# EasyEDA schematic SCH_555Timer_2021-06-30.json
TITLE: 555 TIMER AS ASTABLE MULTIVIBRATOR; REV: 1.0; Date: 2021-06-22; Sheet: 1/1; Drawn By: Surya Narayan Jena; Company: SPECTRUMCET
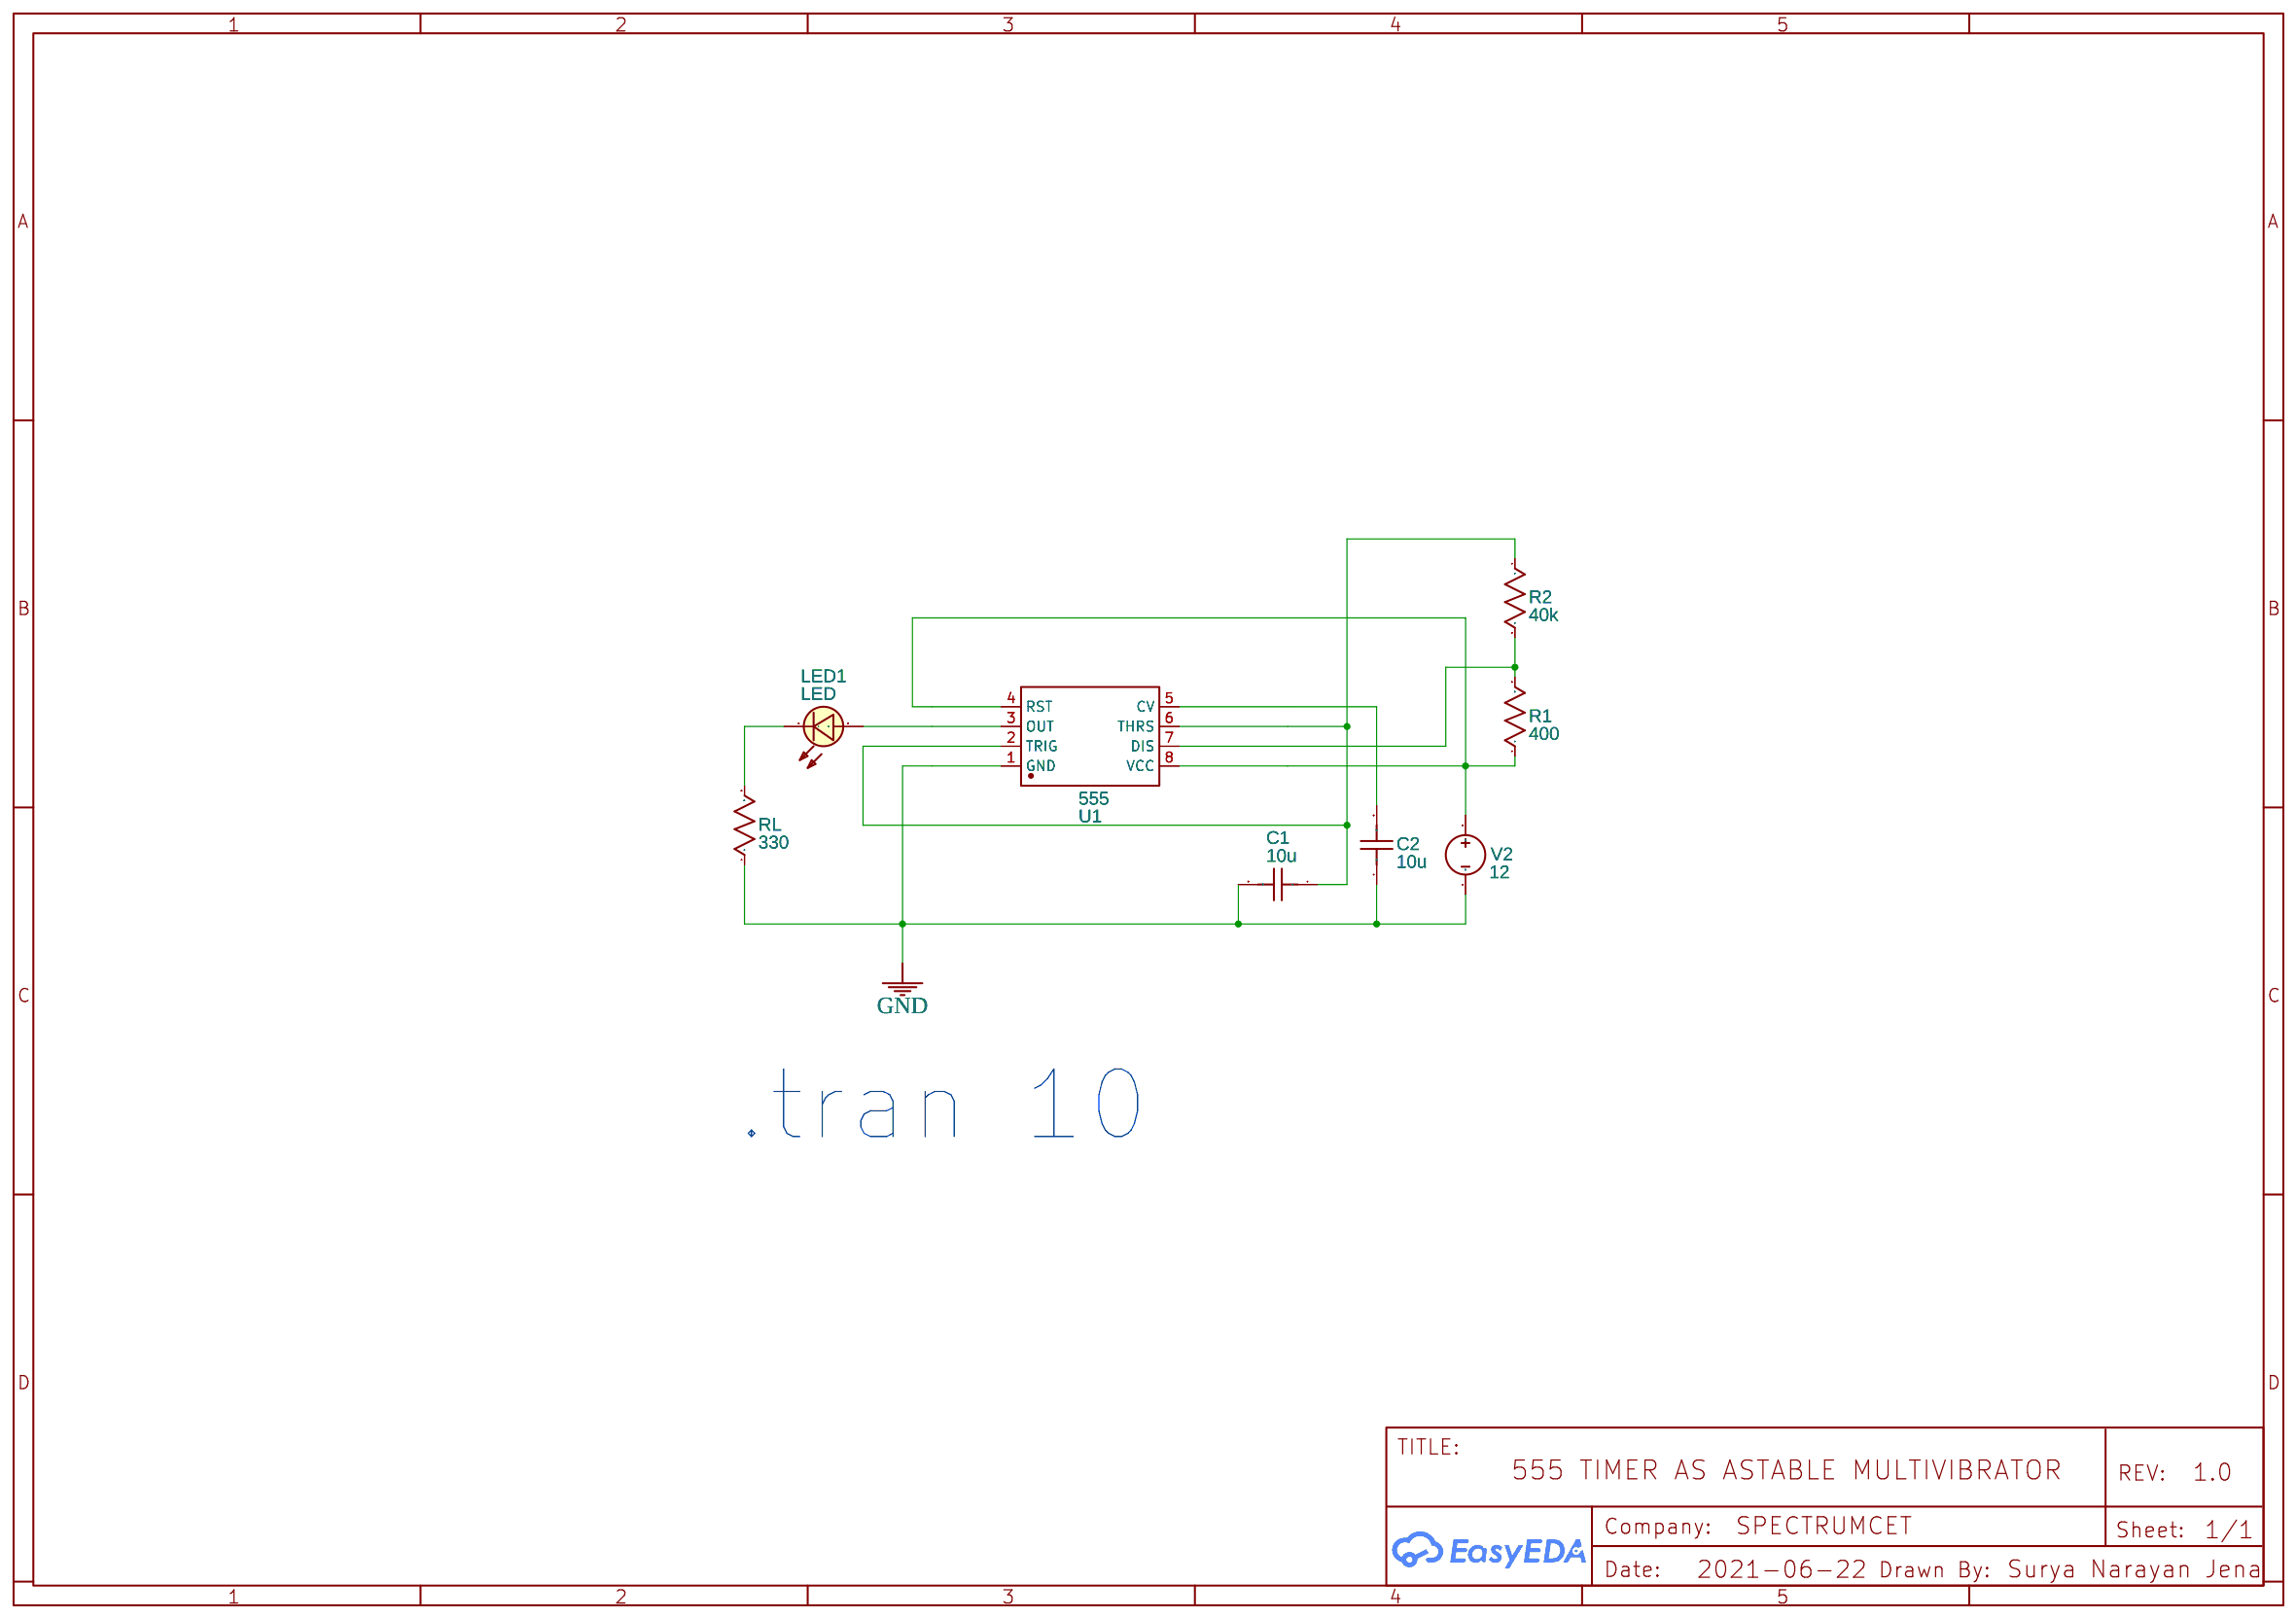
[diagram p0: schematic sheet]

## Parts
C1  10u  [C0603]
C2  10u  [C0603]
LED1  LED  [LED0603_RED]
R1  400  [R0603]
R2  40k  [R0603]
RL  330  [R0603]
U1  555  [DIP8]
V2  12  [HDR1X2]

## Library data of the parts
C1 C2 = C_0603_US: Contributor: LCEDA_Lib
LED1 = LED: catid: 20; Contributor: 仿真库绘制; Color: Green; sim: true
R1 R2 RL = R_0603_US: Contributor: LCEDA_Lib
U1 = 555_BJT_EE: Contributor: Zubairkhan; link: http://www.ti.com/lit/ds/symlink/ne555.pdf; sim: true
V2 = VDC: Contributor: EasyEDA; sim: true

## Nets
GND: C1.2 C2.1 RL.1 U1.1(GND) V2.2
Net-(C1-1): C1.1 R2.1 U1.2(TRIG) U1.6(THRS)
Net-(C2-2): C2.2 U1.5(CV)
Net-(LED1-1): LED1.1(+) U1.3(OUT)
Net-(LED1-2): LED1.2(-) RL.2
Net-(R1-1): R1.1 U1.4(RST) U1.8(VCC) V2.1
Net-(R1-2): R1.2 R2.2 U1.7(DIS)

## Notes on the sheet
- .tran 10
